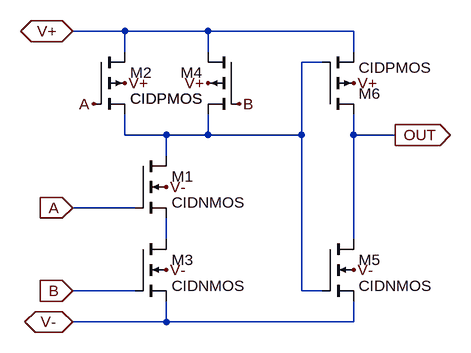
[diagram p0: schematic AND2X1.asc]
AND2X1.asc, the LTspice schematic file:
Version 4.1
SHEET 1 880 680
WIRE 144 -112 64 -112
WIRE 272 -112 144 -112
WIRE 496 -112 272 -112
WIRE 144 -80 144 -112
WIRE 272 -80 272 -112
WIRE 496 -80 496 -112
WIRE 448 -64 416 -64
WIRE 144 48 144 16
WIRE 208 48 144 48
WIRE 272 48 272 16
WIRE 272 48 208 48
WIRE 416 48 416 -64
WIRE 416 48 272 48
WIRE 496 48 496 16
WIRE 560 48 496 48
WIRE 208 80 208 48
WIRE 160 160 64 160
WIRE 208 208 208 176
WIRE 496 208 496 48
WIRE 160 288 64 288
WIRE 416 288 416 48
WIRE 448 288 416 288
WIRE 208 336 208 304
WIRE 208 336 64 336
WIRE 496 336 496 304
WIRE 496 336 208 336
FLAG 64 160 A
IOPIN 64 160 In
FLAG 64 288 B
IOPIN 64 288 In
FLAG 560 48 OUT
IOPIN 560 48 Out
FLAG 96 0 A
FLAG 320 0 B
FLAG 64 336 V-
IOPIN 64 336 BiDir
FLAG 64 -112 V+
IOPIN 64 -112 BiDir
FLAG 208 256 V-
FLAG 208 128 V-
FLAG 144 -32 V+
FLAG 272 -32 V+
FLAG 496 -32 V+
FLAG 496 256 V-
SYMBOL nmos4 160 80 R0
SYMATTR InstName M1
SYMATTR Value CIDNMOS
SYMATTR Value2 l=5u w=10u
SYMBOL pmos4 96 -80 R0
SYMATTR InstName M2
SYMATTR Value CIDPMOS
SYMATTR Value2 l=5u w=25u
SYMBOL nmos4 160 208 R0
SYMATTR InstName M3
SYMATTR Value CIDNMOS
SYMATTR Value2 l=5u w=10u
SYMBOL pmos4 320 -80 M0
SYMATTR InstName M4
SYMATTR Value CIDPMOS
SYMATTR Value2 l=5u w=25u
SYMBOL nmos4 448 208 R0
SYMATTR InstName M5
SYMATTR Value CIDNMOS
SYMATTR Value2 l=5u w=10u
SYMBOL pmos4 448 16 M180
SYMATTR InstName M6
SYMATTR Value CIDPMOS
SYMATTR Value2 l=5u w=25u

The netlist it stands for:
* AND2X1.asc
M1 N001 A N002 V- CIDNMOS l=5u w=10u
M2 V+ A N001 V+ CIDPMOS l=5u w=25u
M3 N002 B V- V- CIDNMOS l=5u w=10u
M4 V+ B N001 V+ CIDPMOS l=5u w=25u
M5 OUT N001 V- V- CIDNMOS l=5u w=10u
M6 OUT N001 V+ V+ CIDPMOS l=5u w=25u
.model NMOS NMOS
.model PMOS PMOS
.lib standard.mos
.backanno
.end